# EAGLE design 009pcb6 (EAGLE 9.6.2)
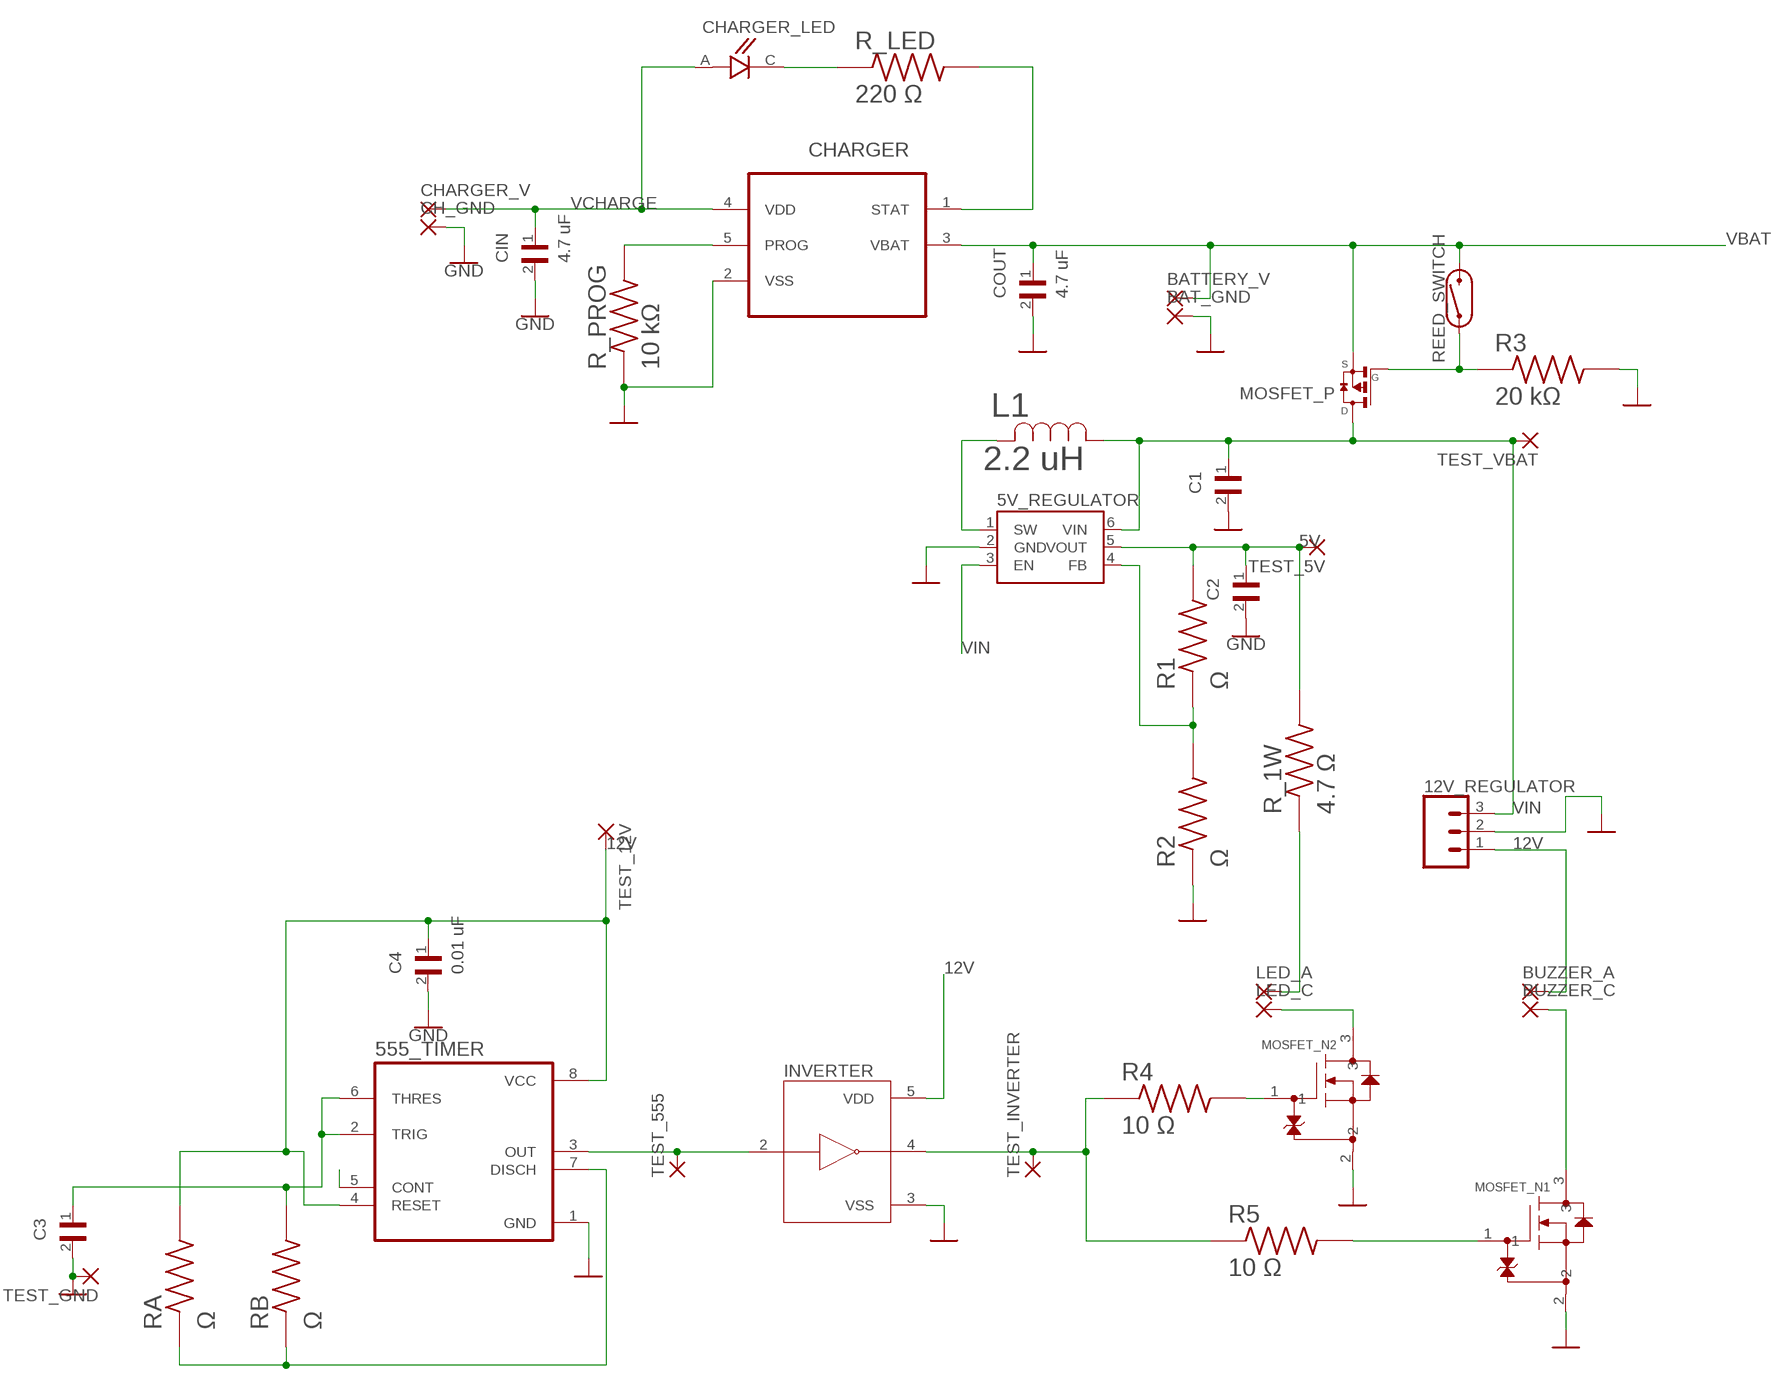
[diagram p0: schematic, sheet 1]

## Parts
5V_REGULATOR  TLV61070ASOT-23  [SOT23-6]
12V_REGULATOR  CONN_03  [1X03]
555_TIMER  NE555DR  [SOIC127P599X175-8N]
BAT_GND  WIREPADSMD1,27-254  [SMD1,27-2,54]
BATTERY_V  WIREPADSMD1,27-254  [SMD1,27-2,54]
BUZZER_A  WIREPADSMD1,27-254  [SMD1,27-2,54]
BUZZER_C  WIREPADSMD1,27-254  [SMD1,27-2,54]
C1  GRT21BR61H475ME13L  [CAPC2012X135N]
C2  GRT21BR61H475ME13L  [CAPC2012X135N]
C3  GRT21BR61H475ME13L  [CAPC2012X135N]
C4  0.01 uF  GRT21BR61H475ME13L  [CAPC2012X135N]
CH_GND  WIREPADSMD1,27-254  [SMD1,27-2,54]
CHARGER  MCP73831T-5ACI/OT  [SOT95P280X145-5N]
CHARGER_LED  5988170107F  [LEDC2012X70N]
CHARGER_V  WIREPADSMD1,27-254  [SMD1,27-2,54]
CIN  4.7 uF  GRT21BR61H475ME13L  [CAPC2012X135N]
COUT  4.7 uF  GRT21BR61H475ME13L  [CAPC2012X135N]
INVERTER  BU4SU69G2-TR  [SOT95P280X125-5N]
L1  2.2 uH  74438357022  [IND_8357022_WRE]
LED_A  WIREPADSMD1,27-254  [SMD1,27-2,54]
LED_C  WIREPADSMD1,27-254  [SMD1,27-2,54]
MOSFET_N1  SSM3K335R  [SOT-23F_TOS]
MOSFET_N2  SSM3K335R  [SOT-23F_TOS]
MOSFET_P  DMP2004K  [SOT23]
R1  Ω  RC0805JR-0720KL  [RESC2012X60N]
R2  Ω  RC0805JR-0720KL  [RESC2012X60N]
R3  20 kΩ  RC0805JR-0720KL  [RESC2012X60N]
R4  10 Ω  RC0805JR-0720KL  [RESC2012X60N]
R5  10 Ω  RC0805JR-0720KL  [RESC2012X60N]
R_1W  4.7 Ω  RC2512FK-074R7L  [RESC6331X65N]
R_LED  220 Ω  RC0805JR-0720KL  [RESC2012X60N]
R_PROG  10 kΩ  RC0805JR-0720KL  [RESC2012X60N]
RA  Ω  RC0805JR-0720KL  [RESC2012X60N]
RB  Ω  RC0805JR-0720KL  [RESC2012X60N]
REED_SWITCH  REED_SWITCH-PTH-GLASS  [REED_SWITCH_GLASS]
TEST_5V  WIREPADSMD1,27-254  [SMD1,27-2,54]
TEST_12V  WIREPADSMD1,27-254  [SMD1,27-2,54]
TEST_555  WIREPADSMD1,27-254  [SMD1,27-2,54]
TEST_GND  WIREPADSMD1,27-254  [SMD1,27-2,54]
TEST_INVERTER  WIREPADSMD1,27-254  [SMD1,27-2,54]
TEST_VBAT  WIREPADSMD1,27-254  [SMD1,27-2,54]

## Nets
5V: 5V_REGULATOR.5(VOUT) C2.1 R1.2 R_1W.2 TEST_5V.1(P)
12V: 12V_REGULATOR.1 555_TIMER.4(RESET) 555_TIMER.8(VCC) BUZZER_A.1(P) C4.1 INVERTER.5(VDD) RA.2 TEST_12V.1(P)
GND: 5V_REGULATOR.2(GND) 12V_REGULATOR.2 555_TIMER.1(GND) BAT_GND.1(P) C1.2 C2.2 C3.2 C4.2 CH_GND.1(P) CHARGER.2(VSS) CIN.2 COUT.2 INVERTER.3(VSS) MOSFET_N1.2 MOSFET_N2.2 R2.1 R3.2 R_PROG.1 TEST_GND.1(P)
N$1: 555_TIMER.5(CONT)
N$2: CHARGER.5(PROG) R_PROG.2
N$3: CHARGER_LED.C R_LED.1
N$4: MOSFET_P.1(G) R3.1 REED_SWITCH.P$1
N$5: CHARGER.1(STAT) R_LED.2
N$6: 555_TIMER.2(TRIG) 555_TIMER.6(THRES) C3.1 RB.2
N$7: LED_A.1(P) R_1W.1
N$8: 555_TIMER.7(DISCH) RA.1 RB.1
N$10: 5V_REGULATOR.1(SW) L1.2
N$11: 555_TIMER.3(OUT) INVERTER.2(A) TEST_555.1(P)
N$12: 5V_REGULATOR.4(FB) R1.1 R2.2
N$13: INVERTER.4(Y) R4.1 R5.1 TEST_INVERTER.1(P)
N$14: MOSFET_N2.1 R4.2
N$15: LED_C.1(P) MOSFET_N2.3
N$18: MOSFET_N1.1 R5.2
N$19: BUZZER_C.1(P) MOSFET_N1.3
VBAT: BATTERY_V.1(P) CHARGER.3(VBAT) COUT.1 MOSFET_P.2(S) REED_SWITCH.P$2
VCHARGE: CHARGER.4(VDD) CHARGER_LED.A CHARGER_V.1(P) CIN.1
VIN: 5V_REGULATOR.3(EN) 5V_REGULATOR.6(VIN) 12V_REGULATOR.3 C1.1 L1.1 MOSFET_P.3(D) TEST_VBAT.1(P)

## Library data of the parts
5V_REGULATOR = TLV61070A:TLV61070A: MCP4725 DAC Microchip 12-bit I2C DAC, SOT23-6 Datasheet <https://cdn.sparkfun.com/datasheets/BreakoutBoards/MCP4725_2009.pdf> SparkFun Products SparkFun I2C DAC Breakout - MCP4725 <https://www.sparkfun.com/products/12918> (BOB-12918); PROD_ID: IC-08886; VALUE: MCP4725
12V_REGULATOR = SparkFun-Connectors:CONN_03: Multi connection point. Often used as Generic Header-pin footprint for 0.1 inch spaced/style header connections On any of the 0.1 inch spaced packages, you can populate with these: Break Away Headers - Straight <https://www.sparkfun.com/products/116> (PRT-00116) Break Away Male Headers - Right Angle <https://www.sparkfun.com/products/553> (PRT-00553) Female Headers <https://www.sparkfun.com/products/115> (PRT-00115) Break Away Headers - Machine Pin <https://www.sparkfun.com/products/117> (PRT-00117) Break Away Female Headers - Swiss Machine Pin <https://www.sparkfun.com/products/743> (PRT-00743) Stackable Header - 3 Pin (Female, 0.1") <https://www.sparkfun.com/products/13875> (PRT-13875) For SCREWTERMINALS and SPRING TERMINALS visit here: Screw Terimnals on SparkFun.com <https://www.sparkfun.com/search/results?term=Screw+Terminals> (5mm/3.5mm/2.54mm spacing) This device is also useful as a general connection point to wire up your design to another part of your project. Our various solder wires solder well into these plated through hole pads. Hook-Up Wire - Assortment (Stranded, 22 AWG) <https://www.sparkfun.com/products/11375> (PRT-11375) Hook-Up Wire - Assortment (Solid Core, 22 AWG) <https://www.sparkfun.com/products/11367> (PRT-11367) View the entire wire category on our website here <https://www.sparkfun.com/categories/141> Special notes: Molex polarized connector foot print use with SKU : PRT-08232 with associated crimp pins and housings.
555_TIMER = NE555DR:NE555DR: None Check availability <https://pricing.snapeda.com/parts/NE555DR/Texas%20Instruments/view-part?ref=eda>; AVAILABILITY: In Stock; DESCRIPTION: Single Precision Timer; MF: Texas Instruments; MP: NE555DR; PACKAGE: SOIC-8 Texas Instruments; PRICE: None; PURCHASE-URL: https://pricing.snapeda.com/search/part/NE555DR/?ref=eda
BAT_GND BATTERY_V BUZZER_A BUZZER_C CH_GND CHARGER_V LED_A LED_C TEST_5V TEST_12V TEST_555 TEST_GND TEST_INVERTER TEST_VBAT = wirepad:WIREPAD: Wire PAD connect wire on PCB
C1-C4 CIN COUT = GRT21BR61H475ME13L:GRT21BR61H475ME13L: Cap Ceramic 4.7uF 50V X5R 20% Pad SMD 0805 85C Automotive T/R Check availability <https://pricing.snapeda.com/parts/GRT21BR61H475ME13L/Murata%20Electronics/view-part?ref=eda>; AVAILABILITY: In Stock; DESCRIPTION: 4.7 µF ±20% 50V Ceramic Capacitor X5R 0805 (2012 Metric); MF: Murata Electronics; MP: GRT21BR61H475ME13L; PACKAGE: 0805 Murata; PRICE: None; PURCHASE-URL: https://pricing.snapeda.com/search/part/GRT21BR61H475ME13L/?ref=eda
CHARGER = MCP73831T-5ACI_OT:MCP73831T-5ACI/OT: Charge Management Controller; DESCRIPTION: Linear Battery Charger Controller Li-Ion/Li-Pol 505mA 4.5V 5-Pin SOT-23 T/R; DIGI-KEY_PART_NUMBER: MCP73831T-5ACI/OTTR-ND; MF: Microchip Technology; MP: MCP73831T-5ACI/OT; PACKAGE: SOT-23-5 Microchip; PURCHASE-URL: https://pricing.snapeda.com/search/part/MCP73831T-5ACI/OT/?ref=eda
CHARGER_LED = 5988170107F:5988170107F: Standard LEDs - SMD Green Water Clr 40mcd 570nm Check availability <https://pricing.snapeda.com/parts/5988170107F/Dialight/view-part?ref=eda>; AVAILABILITY: In Stock; DESCRIPTION: Green 566nm LED Indication - Discrete 2V 0805 (2012 Metric); MF: Dialight; MP: 5988170107F; PACKAGE: 0805 Dialight; PRICE: None; PURCHASE-URL: https://pricing.snapeda.com/search/part/5988170107F/?ref=eda
INVERTER = BU4SU69G2-TR:BU4SU69G2-TR: BU4SU69G2 Series 16 V Surface Mount General Purpose CMOS Logic IC - SSOP-5 Check availability <https://pricing.snapeda.com/parts/BU4SU69G2-TR/Rohm/view-part?ref=eda>; AVAILABILITY: In Stock; DESCRIPTION: Inverter IC 1 Channel - 5-SSOP; MF: Rohm; MP: BU4SU69G2-TR; PACKAGE: SSOP-5 Rohm; PRICE: None; PURCHASE-URL: https://pricing.snapeda.com/search/part/BU4SU69G2-TR/?ref=eda
L1 = 74438357022:74438357022; COPYRIGHT: Copyright (C) 2022 Ultra Librarian. All rights reserved.; DIGI-KEY_PART_NUMBER_1: 732-11201-2-ND; DIGI-KEY_PART_NUMBER_2: 732-11201-1-ND; DIGI-KEY_PART_NUMBER_3: 732-11201-6-ND; MANUFACTURER_PART_NUMBER: 74438357022; MFR_NAME: Wurth Electronics
MOSFET_N1 MOSFET_N2 = SSM3K335R:SSM3K335R; COPYRIGHT: Copyright (C) 2022 Ultra Librarian. All rights reserved.; DIGI-KEY_PART_NUMBER_1: SSM3K335RLFCT-ND; DIGI-KEY_PART_NUMBER_2: SSM3K335RLFDKR-ND; DIGI-KEY_PART_NUMBER_3: SSM3K335RLFTR-ND; MANUFACTURER_PART_NUMBER: SSM3K335R; MFR_NAME: Toshiba Electronic Devices & Storage Corp.
MOSFET_P = DMP2004K:DMP2004K: P-Channel Enhancement MOSFET Check availability <https://pricing.snapeda.com/parts/DMP2004K/Diodes%20Zetex/view-part?ref=eda>; AVAILABILITY: In Stock; DESCRIPTION: Trans MOSFET P-CH 20V 0.6A 3-Pin SOT-23 T/R; MF: Diodes Zetex; MP: DMP2004K; PACKAGE: None; PRICE: None; PURCHASE-URL: https://pricing.snapeda.com/search/part/DMP2004K/?ref=eda
R1-R5 R_LED R_PROG RA RB = RC0805JR-0720KL:RC0805JR-0720KL: THICK FILM RESISTOR, 20KOHM, 125mW, 5%,; DESCRIPTION: 20 kOhms ±5% 0.125W, 1/8W Chip Resistor 0805 (2012 Metric) Moisture Resistant Thick Film; DIGI-KEY_PART_NUMBER: 311-20KARTR-ND; MF: Yageo; MP: RC0805JR-0720KL; PACKAGE: 2012 Rohm Semiconductor; PURCHASE-URL: https://pricing.snapeda.com/search/part/RC0805JR-0720KL/?ref=eda
R_1W = RC2512FK-074R7L:RC2512FK-074R7L: RESISTOR, 2512 1% 4R7; Resistance:4.7ohm; Resistance Tolerance:± 1%; Power Rating:1W; Voltage Rating:200V; Temperature Coefficient:± 200ppm/°C; Resistor Element Material:Thick Film; Resistor Case Style:2512; Resistor Mounting:SMD; SVHC:No SVHC (20-Jun-2011); External Depth:0.55mm; External Length / Height:6.35mm; External Width:3.1mm; No. of Pins:2; Operating Temperature Max:155°C; Operating Temperature Min:-55°C; Operating Temperature Range:-55°C to +155°C; Package / Case:2512; Reel Quantity:4000; Series:PRC221; Temperature Coeff. +:200ppm/°C; Temperature Coeff. -:200ppm/°C; Tolerance +:1%; Tolerance -:1%; Voltage Rating V DC:200V; DESCRIPTION: 4.7 Ohms ±1% 1W Chip Resistor 2512 (6432 Metric) Moisture Resistant Thick Film; DIGI-KEY_PART_NUMBER: 13-RC2512FK-074R7LTR-ND; MF: Yageo; MP: RC2512FK-074R7L; PACKAGE: 6331 Yageo; PURCHASE-URL: https://pricing.snapeda.com/search/part/RC2512FK-074R7L/?ref=eda
REED_SWITCH = RI-80GP0510:REED_SWITCH: Reed Switch A reed switch is a magnetically-actuated switch. When the device is exposed to a magnetic field, the two ferrous materials inside the switch pull together and the switch closes. Variant Overview PTH-GLASS Reed Switch <https://www.sparkfun.com/products/8642> (COM-08642) - PTH reed switch w/ glass body (6.0 x 0.9 mm) PTH-INSULATED Reed Switch - Insulated <https://www.sparkfun.com/products/10601> (COM-10601) - PTH reed switch w/ insulated body (15.1 x 4.2 mm); PROD_ID: SWCH-09282; SF_SKU: COM-08642

## Board
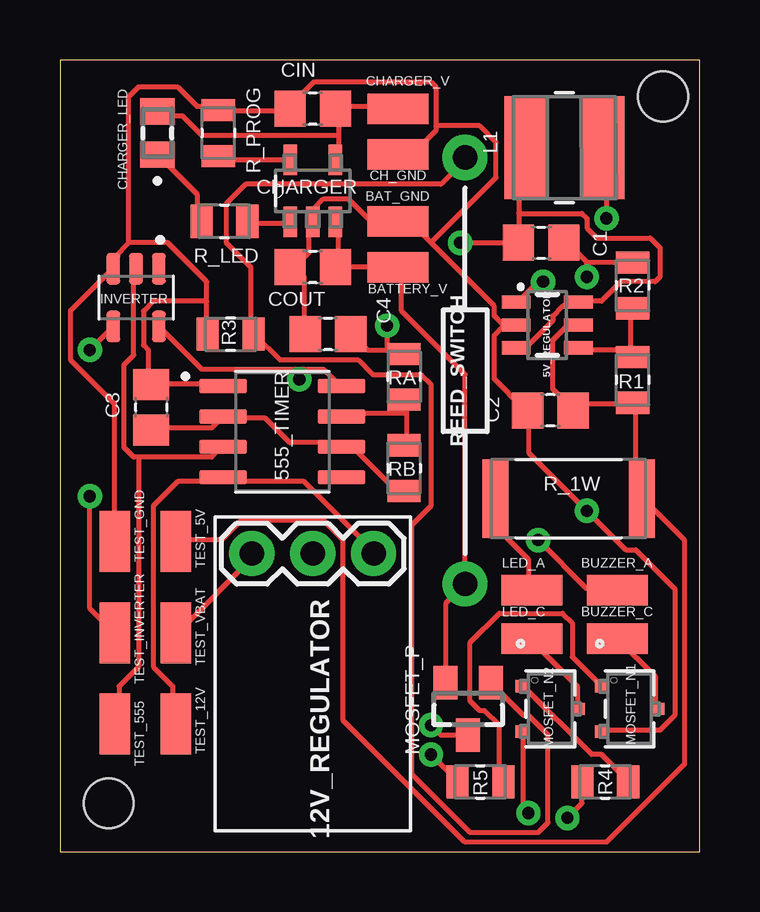
[diagram p1: board, top side]
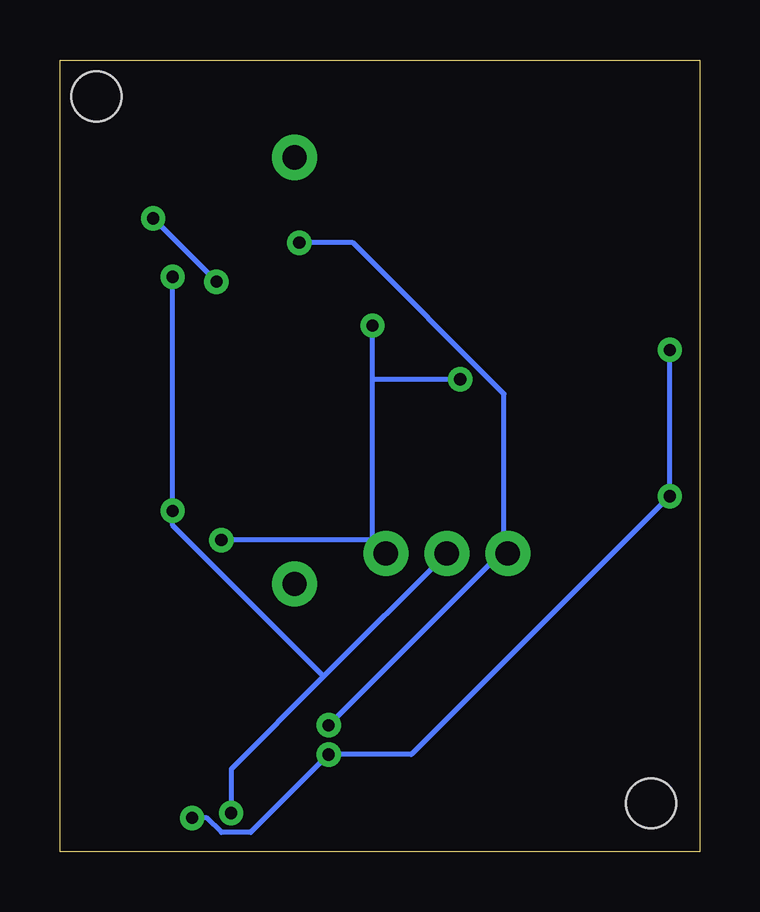
[diagram p2: board, bottom side, seen from below]

Size 26.67 x 33.02 mm. Coordinates in mm from the lower left corner, seen from the top.
Outline: 0,0 26.67,0 26.67,33.02 0,33.02 0,0
Copper layers (1*16): Top 0.035mm / dielectric 1.5mm / Bottom 0.035mm
Design rules "SparkFun": minimum track width 8mil, minimum drill 20mil, track to track 8mil, track to pad 8mil, pad to pad 8mil, via to via 8mil, smd to smd 8mil, copper to edge 10mil, drill to drill 8mil, minimum pad ring 12mil, minimum via ring 10mil, stop-mask expansion 4mil, vias tented up to drill 25mil, thermal gap 10mil
Holes 2.08 mm at 2.03,2.03 25.15,31.5

### Footprints (pad centres in the part's own frame; a part is rotated, then mirrored left to right if it is on the bottom)
SOT23-6 = smd 0.55 x 1.2: 1 0.95,1.3; 2 0,1.3; 3 -0.95,1.3; 4 -0.95,-1.3; 5 0,-1.3; 6 0.95,-1.3
1X03 = drill 1.016 pad 1.88: 1 0,0; 2 2.54,0; 3 5.08,0
SOIC127P599X175-8N = smd 1.97 x 0.6: 1 -2.47,1.905; 2 -2.47,0.635; 3 -2.47,-0.635; 4 -2.47,-1.905; 5 2.47,-1.905; 6 2.47,-0.635; 7 2.47,0.635; 8 2.47,1.905
SMD1,27-2,54 = smd 1.27 x 2.54: 1 0,0
CAPC2012X135N = smd 1.3 x 1.5: 1 -0.95,0; 2 0.95,0
SOT95P280X145-5N = smd 1.27 x 0.559: 1 -1.295,0.94; 2 -1.295,0; 3 -1.295,-0.94; 4 1.295,-0.94; 5 1.295,0.94
LEDC2012X70N = smd 1.1 x 1.45: A 0.9,0; C -0.9,0
SOT95P280X125-5N = smd 1.31 x 0.58: 1 -1.205,0.95; 2 -1.205,0; 3 -1.205,-0.95; 4 1.205,-0.95; 5 1.205,0.95
IND_8357022_WRE = smd 1.803 x 4.293: 1 -1.6,0; 2 1.6,0
SOT-23F_TOS = smd 0.508 x 0.508: 1 -0.95,-1.194; 2 0.95,-1.194; 3 0,1.194
SOT23 = smd 1 x 1.4: 1 -0.95,-1.1; 2 0.95,-1.1; 3 0,1.1
RESC2012X60N = smd 0.92 x 1.38: 1 -0.955,0; 2 0.955,0
RESC6331X65N = smd 1.07 x 3.27: 1 -3.055,0; 2 3.055,0
REED_SWITCH_GLASS = drill 1.016 pad 1.88: P$1 -8.89,0; P$2 8.89,0

### Placement (x,y rotation side)
5V_REGULATOR  20.32,21.97 90 top
12V_REGULATOR  13.08,12.45 180 top
555_TIMER  9.27,17.53 0 top
BAT_GND  14.1,26.29 90 top
BATTERY_V  14.1,24.38 270 top
BUZZER_A  23.24,10.92 270 top
BUZZER_C  23.24,8.89 270 top
C1  20.07,25.4 0 top
C2  20.45,18.41 180 top
C3  3.81,18.54 90 top
C4  11.18,21.59 180 top
CH_GND  14.1,29.08 90 top
CHARGER  10.54,27.56 90 top
CHARGER_LED  4.06,29.97 90 top
CHARGER_V  14.1,30.99 90 top
CIN  10.54,30.99 180 top
COUT  10.54,24.38 180 top
INVERTER  3.17,23.11 270 top
L1  21.03,29.36 0 top
LED_A  19.68,10.92 90 top
LED_C  19.68,8.89 90 top
MOSFET_N1  23.75,5.97 270 top
MOSFET_N2  20.45,5.97 270 top
MOSFET_P  17.02,5.97 180 top
R1  23.88,19.68 270 top
R2  23.88,23.62 270 top
R3  7.11,21.59 180 top
R4  22.73,2.92 0 top
R5  17.53,2.92 0 top
R_1W  21.21,14.73 0 top
R_LED  6.86,26.29 0 top
R_PROG  6.6,29.97 270 top
RA  14.35,19.81 90 top
RB  14.35,16 270 top
REED_SWITCH  16.89,20.07 270 top
TEST_5V  4.83,12.95 0 top
TEST_12V  4.83,5.33 0 top
TEST_555  2.29,5.33 0 top
TEST_GND  2.29,12.95 0 top
TEST_INVERTER  2.29,9.14 0 top
TEST_VBAT  4.83,9.14 0 top

### Tracks (layer width: path | path; a pad name or v marks a point on that pad's centre or on a via)
5V
  Top 0.203: 5V_REGULATOR.5 21.57,21.95 21.16,21.95 20.55,21.34 20.55,19.3 21.36,18.49 C2.1 21.57,18.49 21.77,18.69 23.8,18.69 R1.2 24,18.69 24,15.04 24.21,14.83 R_1W.2 24.41,14.63 26.04,13.01 26.04,3.66 22.78,0.41 16.89,0.41 11.81,5.49 11.81,13.01 11,13.82 7.54,13.82 6.73,13.01 4.9,13.01 TEST_5V.1
12V  (via drill 0.51)
  Top 0.203: 9.98,20.12 11,20.12 11.61,19.51 555_TIMER.8 | 9.98,20.12 5.92,20.12 4.29,21.74 INVERTER.5 | 13.64,20.93 12.83,20.93 12.22,21.54 C4.1 | 13.64,20.93 14.25,20.93 RA.2 | 12V_REGULATOR.1 13.03,12.6 10.19,15.44 6.93,15.44 555_TIMER.4 6.73,15.44 4.9,15.44 3.89,14.43 3.89,7.72 4.7,6.91 4.7,5.49 TEST_12V.1 | v13.64,21.95 13.64,20.93 | v19.94,13.01 21.97,10.97 23.19,10.97 BUZZER_A.1 | v9.98,19.71 9.98,20.12
  Bottom 0.203: 13.64,13.01 13.64,19.71 | 13.64,19.71 v13.64,21.95 | 13.64,13.01 12V_REGULATOR.1 13.23,12.6 | 13.64,13.01 v19.94,13.01 | 13.64,19.71 v9.98,19.71
GND  (via drill 0.51)
  Top 0.203: 21.97,24.59 23.8,24.59 R2.1 | 21.97,24.59 21.16,25.4 C1.2 | v19.53,1.63 19.33,1.83 19.33,4.88 MOSFET_N2.2 | v21.97,23.98 21.97,24.59 | 555_TIMER.1 6.73,19.51 3.89,19.51 C3.2 3.68,19.51 3.68,20.93 3.48,21.13 3.48,22.55 3.89,22.96 6.12,22.96 | 2.87,25.4 2.26,24.79 2.26,24.38 INVERTER.3 2.06,24.18 0.43,22.55 0.43,20.52 2.26,18.69 2.26,13.01 TEST_GND.1 | 2.87,25.4 4.5,25.4 6.12,23.77 6.12,22.96 | 6.12,22.96 6.12,21.74 R3.2 | 2.87,25.4 2.87,31.5 3.28,31.9 4.9,31.9 5.71,31.09 6.53,31.09 R_PROG.1 6.73,30.89 9.58,30.89 CIN.2 9.58,31.09 10.59,32.11 15.47,32.11 15.67,31.9 15.67,30.28 | 15.67,30.28 15.67,30.07 14.86,29.26 14.25,29.26 CH_GND.1 | 9.78,24.38 10.39,24.99 10.39,26.21 CHARGER.2 10.59,26.42 10.59,26.82 11,27.23 12.01,27.23 12.83,26.42 14.05,26.42 BAT_GND.1 14.25,26.21 14.66,26.21 15.47,25.4 | 9.78,24.38 10.19,23.98 10.19,21.74 C4.2 | 9.78,24.38 COUT.2 | MOSFET_N1.2 22.58,5.08 25.02,5.08 25.63,5.69 25.63,10.97 24,12.6 23.6,12.6 v21.97,14.22 19.53,16.66 19.53,18.29 C2.2 19.33,18.49 18.11,19.71 18.11,21.54 18.52,21.95 | 18.52,21.95 18.92,21.95 5V_REGULATOR.2 18.52,21.95 | 15.47,25.4 18.11,22.76 18.11,22.35 18.52,21.95 | 15.67,30.28 17.5,30.28 18.19,29.59 18.19,28.12 15.47,25.4
  Bottom 0.203: v19.53,1.63 19.53,3.45 15.67,7.32 | 12V_REGULATOR.2 15.67,7.32 | v21.97,23.98 v21.97,14.22 21.97,13.61 15.67,7.32
N$2
  Top 0.203: CHARGER.5 6.73,28.85 R_PROG.2
N$3
  Top 0.203: R_LED.1 5.71,26.42 5.71,27.43 4.09,29.06 CHARGER_LED.C
N$4
  Top 0.203: REED_SWITCH.P$1 16.89,28.85 15.88,27.84 7.75,27.84 6.93,27.03 6.93,25.4 7.95,24.38 7.95,21.74 R3.1 8.15,21.54 9.17,20.52 12.42,20.52 13.03,19.91 15.06,19.91 15.47,19.51 15.47,14.43 14.66,13.61 14.66,3.25 17.09,0.81 19.94,0.81 20.34,1.22 20.34,4.88 19.53,5.69 19.33,5.69 18.11,6.91 MOSFET_P.1
N$5
  Top 0.203: CHARGER.1 9.58,26.21 7.95,26.21 R_LED.2
N$6
  Top 0.203: C3.1 3.89,17.68 6.33,17.68 6.73,18.09 555_TIMER.2 6.93,18.09 8.56,18.09 9.58,17.07 11.61,17.07 555_TIMER.6 11.81,16.87 12.22,16.87 13.84,15.24 14.25,15.24 RB.2
N$7
  Top 0.203: LED_A.1 19.53,10.97 19.53,12.19 18.31,13.41 18.31,14.63 R_1W.1
N$8
  Top 0.203: 14.45,18.29 14.45,18.69 RA.1 | 14.45,18.29 14.45,17.07 RB.1 | 14.45,18.29 11.81,18.29 555_TIMER.7
N$10  (via drill 0.51)
  Top 0.203: v20.14,23.77 19.94,23.77 19.13,22.96 5V_REGULATOR.1 | L1.2 22.78,29.21 v22.78,26.42
  Bottom 0.203: v22.78,26.42 v20.14,23.77
N$11
  Top 0.203: 3.28,16.46 6.33,16.46 6.73,16.87 555_TIMER.3 | 3.28,16.46 3.07,16.46 2.67,16.87 2.67,20.32 3.07,20.73 3.07,24.18 INVERTER.2 | 3.28,16.46 3.28,7.72 2.46,6.91 2.46,5.49 TEST_555.1
N$12
  Top 0.203: 23.8,20.73 23.6,20.93 21.77,20.93 5V_REGULATOR.4 | 23.8,20.73 23.8,22.55 R2.2 | 23.8,20.73 R1.1
N$13  (via drill 0.51)
  Top 0.203: v1.25,20.93 2.06,21.74 INVERTER.4 | v1.25,14.83 1.25,10.16 2.26,9.14 TEST_INVERTER.1 | v15.47,4.06 16.48,3.05 R5.1 | v21.16,1.42 21.77,2.03 21.77,2.85 R4.1
  Bottom 0.203: v1.25,20.93 v1.25,14.83 12.01,4.06 v15.47,4.06 18.72,0.81 19.94,0.81 20.55,1.42 v21.16,1.42
N$14
  Top 0.203: MOSFET_N2.1 19.33,6.91 22.17,4.06 22.58,4.06 23.6,3.05 R4.2
N$15
  Top 0.203: MOSFET_N2.3 21.57,6.1 21.57,6.91 19.74,8.74 LED_C.1
N$18
  Top 0.203: MOSFET_N1.1 22.38,7.11 21.36,8.13 21.36,9.55 20.95,9.96 18.31,9.96 17.09,8.74 17.09,6.3 17.5,5.89 17.7,5.89 18.31,5.28 18.31,3.05 R5.2
N$19
  Top 0.203: BUZZER_C.1 24.82,7.32 24.82,6.1 MOSFET_N1.3
VBAT
  Top 0.203: 11.61,24.38 11.61,26.21 CHARGER.3 | 11.61,24.38 BATTERY_V.1 14.25,24.38 14.25,22.55 16.89,19.91 REED_SWITCH.P$2 16.08,10.36 16.08,7.11 MOSFET_P.2 | 11.61,24.38 COUT.1
VCHARGE
  Top 0.203: 11.61,29.87 11.61,30.89 CIN.1 11.61,31.09 14.05,31.09 CHARGER_V.1 | 11.61,29.87 11.61,28.85 CHARGER.4 | 11.61,29.87 5.92,29.87 5.11,30.68 4.09,30.68 CHARGER_LED.A
VIN  (via drill 0.51)
  Top 0.203: 5V_REGULATOR.3 19.13,21.13 19.53,21.13 20.55,22.15 20.55,22.35 20.95,22.76 21.57,22.76 5V_REGULATOR.6 21.77,22.96 22.58,22.96 23.39,23.77 24.82,23.77 25.02,23.98 25.02,25.2 24.61,25.6 22.38,25.6 21.97,26.01 21.97,26.42 21.77,26.62 19.13,26.62 | 19.13,26.62 19.13,28.85 19.43,29.16 L1.1 | 19.13,26.62 C1.1 v16.69,25.4 | v15.47,5.28 15.88,4.88 16.89,4.88 MOSFET_P.3 | TEST_VBAT.1 4.9,9.14 8.15,12.39 12V_REGULATOR.3
  Bottom 0.203: 8.15,12.6 v15.47,5.28 | v16.69,25.4 14.45,25.4 8.15,19.1 8.15,12.6 | 8.15,12.6 12V_REGULATOR.3